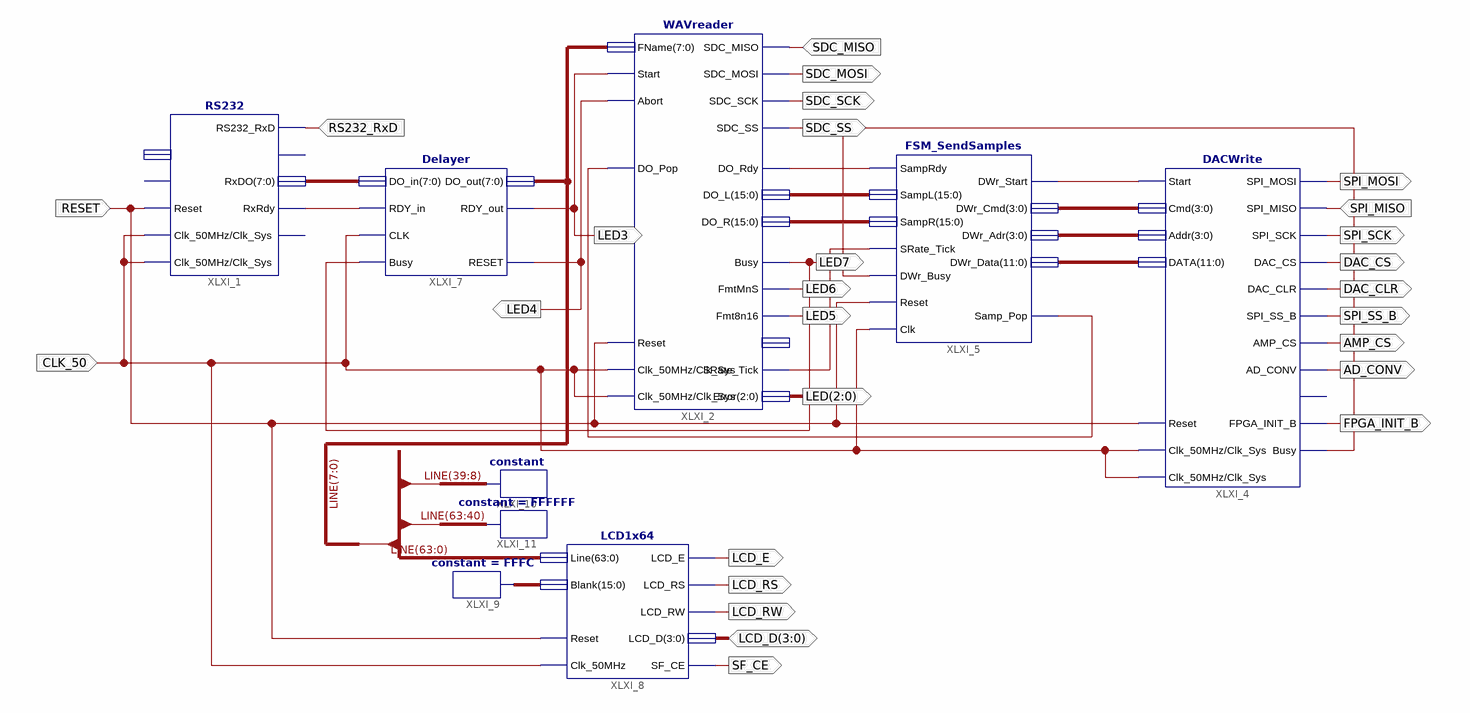
[diagram p0: schematic sheet 1]
// Xilinx ISE schematic instrument.sch (spartan3e) as structural Verilog: 9 symbols, 27 ports
module instrument (
  input  CLK_50,
  input  RESET,
  input  RS232_RxD,
  input  SDC_MISO,
  input  SPI_MISO,
  inout  [3:0] LCD_D,
  output LED3,
  output LED4,
  output LED7,
  output SDC_MOSI,
  output SDC_SCK,
  output SDC_SS,
  output LED6,
  output LED5,
  output [2:0] LED,
  output SPI_MOSI,
  output SPI_SCK,
  output DAC_CS,
  output DAC_CLR,
  output SPI_SS_B,
  output AMP_CS,
  output AD_CONV,
  output FPGA_INIT_B,
  output LCD_E,
  output LCD_RS,
  output LCD_RW,
  output SF_CE
);

  wire XLXN_2, XLXN_10, XLXN_11, XLXN_15, XLXN_16, XLXN_26;
  wire [3:0] XLXN_19, XLXN_20;
  wire [7:0] XLXN_58;
  wire [11:0] XLXN_21;
  wire [15:0] XLXN_12, XLXN_13, XLXN_57;
  wire [63:0] LINE;

  RS232 XLXI_1 (
    .Clk_50MHz(CLK_50), .Reset(RESET), .RS232_RxD(RS232_RxD), .RxRdy(XLXN_2), .RxDO(XLXN_58), .Clk_Sys(CLK_50));  // open: TxStart, TxDI, TxBusy, RS232_TxD
  WAVreader XLXI_2 (
    .FName(LINE[7:0]), .Start(LED3), .Abort(LED4), .SDC_MOSI(SDC_MOSI), .SDC_SCK(SDC_SCK), .SDC_SS(SDC_SS),
    .SDC_MISO(SDC_MISO), .DO_Pop(XLXN_10), .FmtMnS(LED6), .Fmt8n16(LED5), .SRate_Tick(XLXN_15), .Error(LED),
    .Reset(RESET), .Clk_50MHz(CLK_50), .Clk_Sys(CLK_50), .DO_Rdy(XLXN_11), .DO_L(XLXN_12), .DO_R(XLXN_13),
    .Busy(LED7));  // open: FmtSRate
  DACWrite XLXI_4 (
    .Reset(RESET), .Start(XLXN_16), .SPI_MISO(SPI_MISO), .Cmd(XLXN_19), .Addr(XLXN_20), .DATA(XLXN_21),
    .DAC_CLR(DAC_CLR), .DAC_CS(DAC_CS), .SPI_MOSI(SPI_MOSI), .SPI_SCK(SPI_SCK), .SPI_SS_B(SPI_SS_B),
    .AMP_CS(AMP_CS), .AD_CONV(AD_CONV), .FPGA_INIT_B(FPGA_INIT_B), .Busy(XLXN_26), .Clk_50MHz(CLK_50),
    .Clk_Sys(CLK_50));  // open: SF_CE0
  FSM_SendSamples XLXI_5 (
    .Clk(CLK_50), .Reset(RESET), .SRate_Tick(XLXN_15), .SampRdy(XLXN_11), .DWr_Busy(XLXN_26),
    .SampL(XLXN_12), .SampR(XLXN_13), .Samp_Pop(XLXN_10), .DWr_Start(XLXN_16), .DWr_Cmd(XLXN_19),
    .DWr_Adr(XLXN_20), .DWr_Data(XLXN_21));
  Delayer XLXI_7 (
    .RDY_in(XLXN_2), .CLK(CLK_50), .Busy(LED7), .DO_in(XLXN_58), .RDY_out(LED3), .RESET(LED4),
    .DO_out(LINE[7:0]));
  LCD1x64 XLXI_8 (
    .Clk_50MHz(CLK_50), .Reset(RESET), .Line(LINE), .Blank(XLXN_57), .LCD_D(LCD_D), .LCD_E(LCD_E),
    .LCD_RW(LCD_RW), .LCD_RS(LCD_RS), .SF_CE(SF_CE));
  constant #(.CValue("FFFC")) XLXI_9 (.O(XLXN_57));
  constant XLXI_10 (.O(LINE[39:8]));
  constant #(.CValue("FFFFFF")) XLXI_11 (.O(LINE[63:40]));
endmodule
